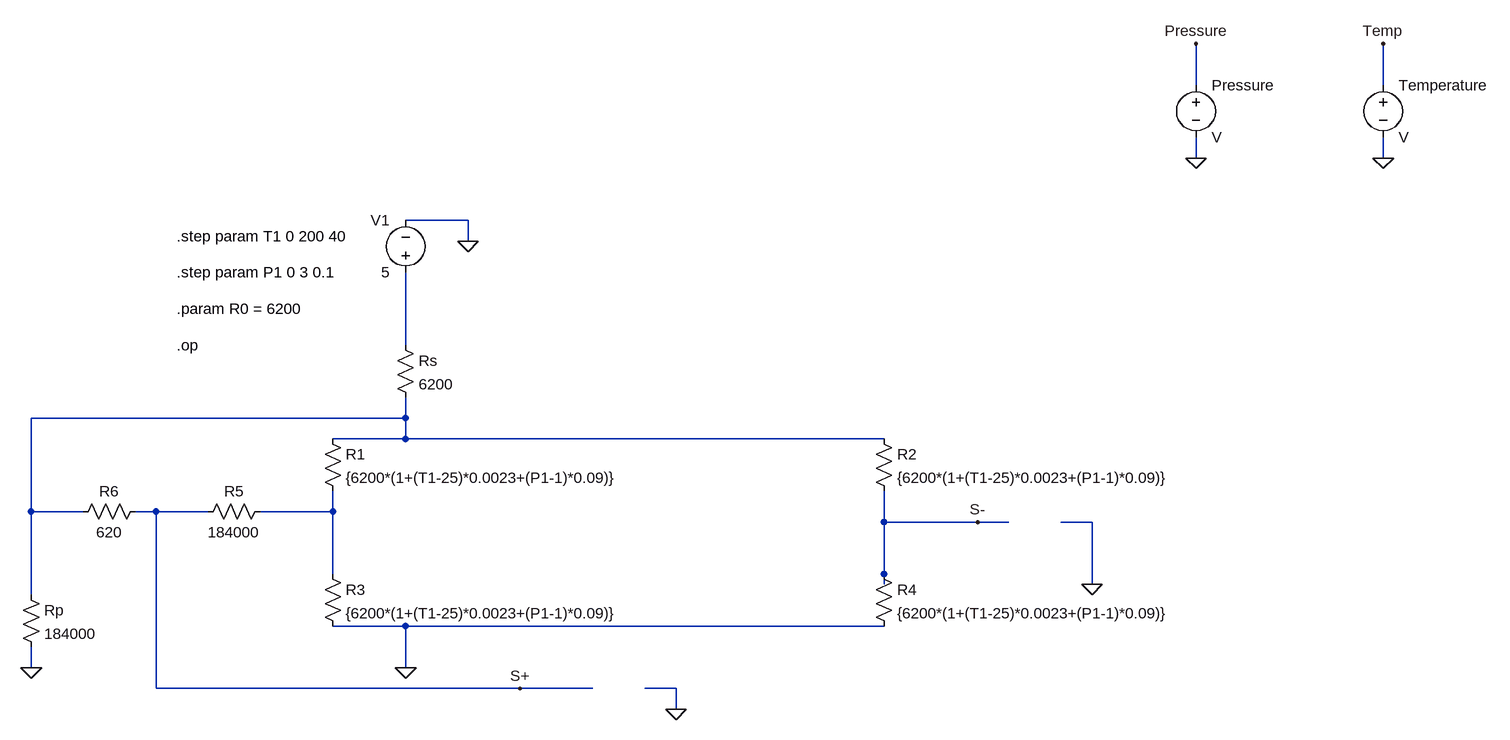
[diagram p0: schematic SimB.asc]
SimB.asc, the LTspice schematic file:
Version 4
SHEET 1 2032 680
WIRE 1568 -416 1568 -480
WIRE 1856 -416 1856 -480
WIRE 1568 -304 1568 -336
WIRE 1856 -304 1856 -336
WIRE 448 -208 352 -208
WIRE 448 -176 448 -208
WIRE 352 -16 352 -128
WIRE 352 96 352 64
WIRE 352 96 -224 96
WIRE 352 128 352 96
WIRE 352 128 240 128
WIRE 1088 128 352 128
WIRE -224 240 -224 96
WIRE -144 240 -224 240
WIRE -32 240 -64 240
WIRE 48 240 -32 240
WIRE 240 240 240 208
WIRE 240 240 128 240
WIRE 1088 256 1088 208
WIRE 1232 256 1088 256
WIRE 1280 256 1232 256
WIRE 1408 256 1360 256
WIRE 240 336 240 240
WIRE 1088 336 1088 256
WIRE 1088 352 1088 336
WIRE 1408 352 1408 256
WIRE -224 368 -224 240
WIRE 352 416 240 416
WIRE 1088 416 352 416
WIRE -224 480 -224 448
WIRE 352 480 352 416
WIRE -32 512 -32 240
WIRE 528 512 -32 512
WIRE 640 512 528 512
WIRE 768 512 720 512
WIRE 768 544 768 512
FLAG 352 480 0
FLAG 528 512 S+
FLAG 1232 256 S-
FLAG 1408 352 0
FLAG 768 544 0
FLAG 448 -176 0
FLAG 1568 -304 0
FLAG 1856 -304 0
FLAG 1568 -480 Pressure
FLAG 1856 -480 Temp
FLAG -224 480 0
SYMBOL res 224 112 R0
SYMATTR InstName R1
SYMATTR Value {6200*(1+(T1-25)*0.0023+(P1-1)*0.09)}
SYMBOL res 1072 112 R0
SYMATTR InstName R2
SYMATTR Value {6200*(1+(T1-25)*0.0023+(P1-1)*0.09)}
SYMBOL res 224 320 R0
SYMATTR InstName R3
SYMATTR Value {6200*(1+(T1-25)*0.0023+(P1-1)*0.09)}
SYMBOL res 1072 320 R0
SYMATTR InstName R4
SYMATTR Value {6200*(1+(T1-25)*0.0023+(P1-1)*0.09)}
SYMBOL res -240 352 R0
SYMATTR InstName Rp
SYMATTR Value 184000
SYMBOL res 336 -32 R0
SYMATTR InstName Rs
SYMATTR Value 6200
SYMBOL voltage 352 -112 R180
WINDOW 0 24 96 Left 2
WINDOW 3 24 16 Left 2
WINDOW 123 0 0 Left 0
WINDOW 39 0 0 Left 0
SYMATTR InstName V1
SYMATTR Value 5
SYMBOL voltage 1568 -432 R0
SYMATTR InstName Pressure
SYMBOL voltage 1856 -432 R0
SYMATTR InstName Temperature
SYMBOL res 144 224 R90
WINDOW 0 0 56 VBottom 2
WINDOW 3 32 56 VTop 2
SYMATTR InstName R5
SYMATTR Value 184000
SYMBOL res -48 224 R90
WINDOW 0 0 56 VBottom 2
WINDOW 3 32 56 VTop 2
SYMATTR InstName R6
SYMATTR Value 620
TEXT 0 -184 Left 2 !.step param T1 0 200 40
TEXT 0 -128 Left 2 !.step param P1 0 3 0.1
TEXT 0 -72 Left 2 !.param R0 = 6200
TEXT 0 -16 Left 2 !.op

The netlist it stands for:
* SimB.asc
R1 N002 N003 {6200*(1+(T1-25)*0.0023+(P1-1)*0.09)}
R2 N002 S- {6200*(1+(T1-25)*0.0023+(P1-1)*0.09)}
R3 N003 0 {6200*(1+(T1-25)*0.0023+(P1-1)*0.09)}
R4 S- 0 {6200*(1+(T1-25)*0.0023+(P1-1)*0.09)}
Rp N002 0 184000
Rs N001 N002 6200
V1 N001 0 5
V§Pressure Pressure 0 V
V§Temperature Temp 0 V
R5 N003 S+ 184000
R6 S+ N002 620
.step param T1 0 200 40
.step param P1 0 3 0.1
.param R0 = 6200
.op
.backanno
.end

* Results of the author's LTspice run, read from the files saved beside the schematic
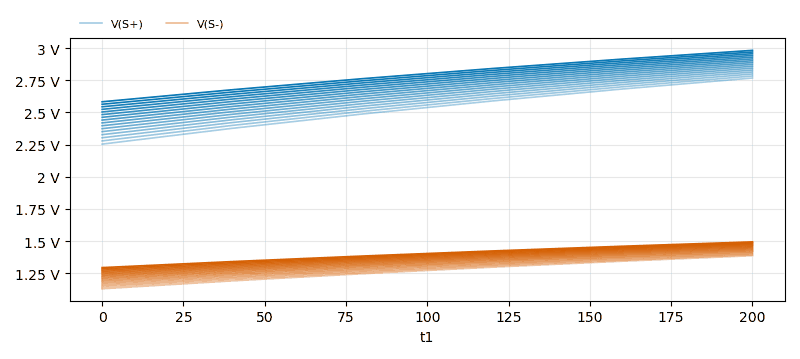
[diagram p1: Operating Point of SimB.asc, plotted from the saved traces]
* Operating Point, 31 runs:
*   V(S+) [run 1]: 2.254 V at t1=0, 2.767 V at t1=200 , min 2.254 V, max 2.767 V
*   V(S+) [run 2]: 2.279 V at t1=0, 2.783 V at t1=200 , min 2.279 V, max 2.783 V
*   V(S+) [run 3]: 2.303 V at t1=0, 2.799 V at t1=200 , min 2.303 V, max 2.799 V
*   V(S+) [run 4]: 2.327 V at t1=0, 2.814 V at t1=200 , min 2.327 V, max 2.814 V
*   V(S+) [run 5]: 2.351 V at t1=0, 2.83 V at t1=200 , min 2.351 V, max 2.83 V
*   V(S+) [run 6]: 2.374 V at t1=0, 2.844 V at t1=200 , min 2.374 V, max 2.844 V
*   V(S+) [run 7]: 2.396 V at t1=0, 2.859 V at t1=200 , min 2.396 V, max 2.859 V
*   V(S+) [run 8]: 2.419 V at t1=0, 2.874 V at t1=200 , min 2.419 V, max 2.874 V
*   V(S-) [run 1]: 1.129 V at t1=0, 1.386 V at t1=200 , min 1.129 V, max 1.386 V
*   V(S-) [run 2]: 1.141 V at t1=0, 1.394 V at t1=200 , min 1.141 V, max 1.394 V
*   V(S-) [run 3]: 1.153 V at t1=0, 1.402 V at t1=200 , min 1.153 V, max 1.402 V
*   V(S-) [run 4]: 1.165 V at t1=0, 1.409 V at t1=200 , min 1.165 V, max 1.409 V
*   V(S-) [run 5]: 1.177 V at t1=0, 1.417 V at t1=200 , min 1.177 V, max 1.417 V
*   V(S-) [run 6]: 1.189 V at t1=0, 1.425 V at t1=200 , min 1.189 V, max 1.425 V
*   V(S-) [run 7]: 1.2 V at t1=0, 1.432 V at t1=200 , min 1.2 V, max 1.432 V
*   V(S-) [run 8]: 1.211 V at t1=0, 1.439 V at t1=200 , min 1.211 V, max 1.439 V